# Altium schematic sheet ZHSD-Block.SchDoc
size A4; DrawnBy: UGUR KELES; DocumentNumber: 2; SheetNumber: 1; SheetTotal: 16; Size: A4
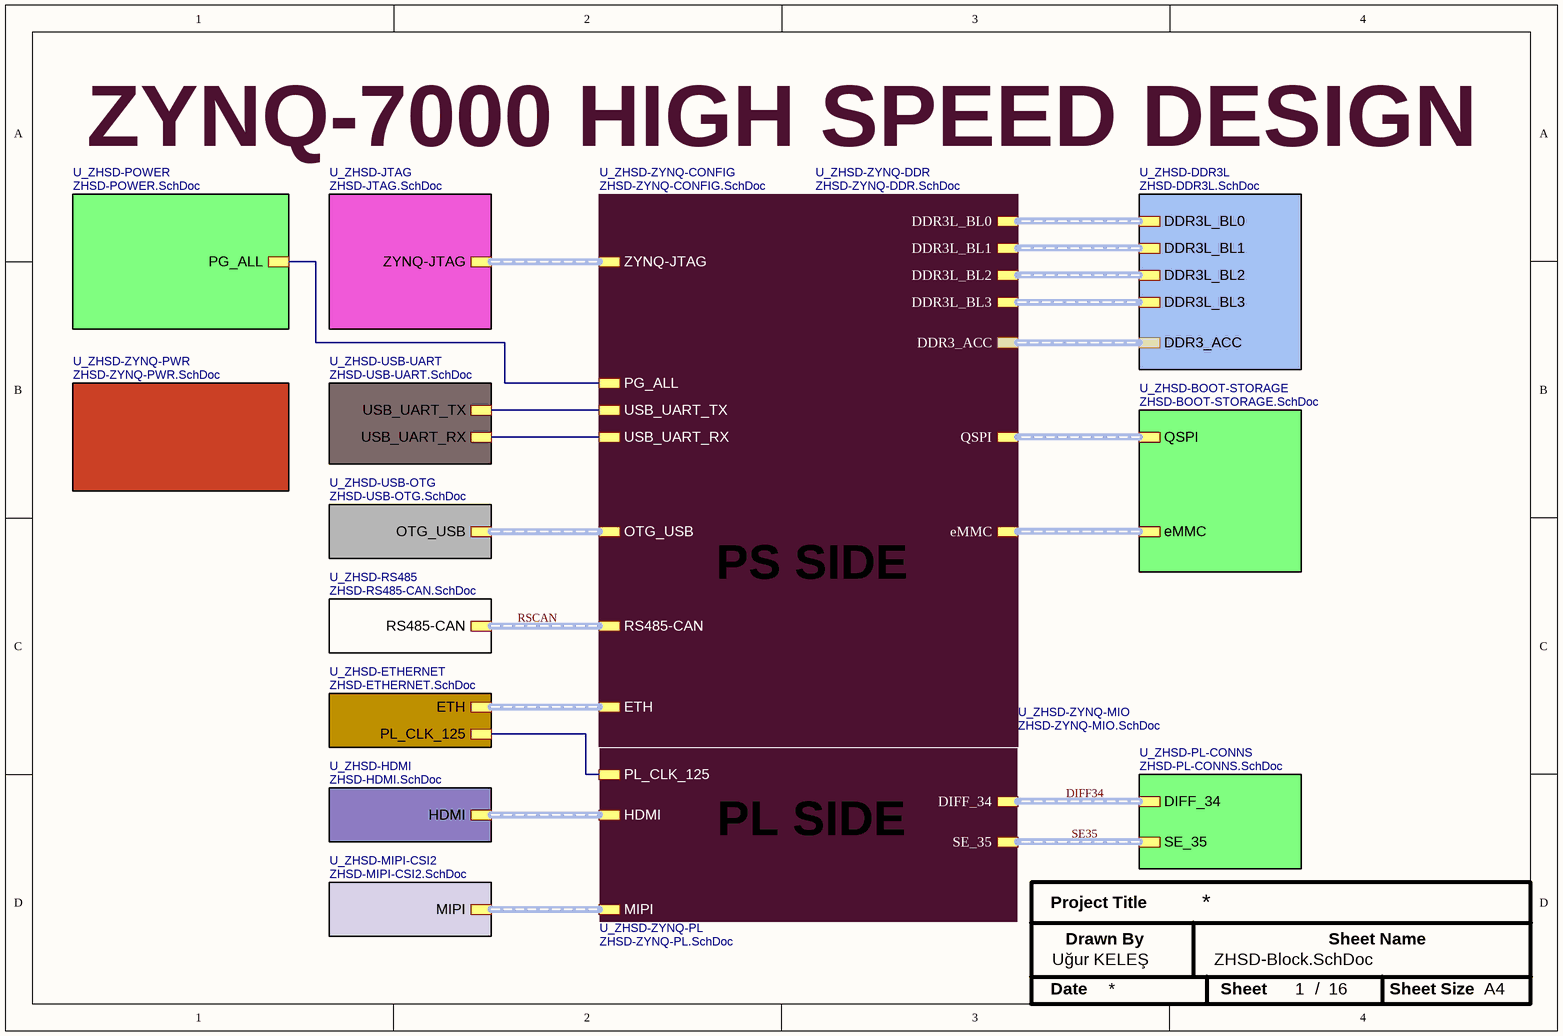
[diagram p0: ZHSD-Block.SchDoc]

## Sub-sheets
U_ZHSD-BOOT-STORAGE = ZHSD-BOOT-STORAGE.SchDoc: QSPI (harness QSPI), eMMC (harness eMMC)
U_ZHSD-DDR3L = ZHSD-DDR3L.SchDoc: DDR3_ACC (harness DDR3_ACC), DDR3L_BL0 (harness DDR_H_BL0), DDR3L_BL1 (harness DDR_H_BL1), DDR3L_BL2 (harness DDR_H_BL2), DDR3L_BL3 (harness DDR_H_BL3)
U_ZHSD-ETHERNET = ZHSD-ETHERNET.SchDoc: ETH (harness ETH), PL_CLK_125
U_ZHSD-HDMI = ZHSD-HDMI.SchDoc: HDMI (harness HDMI)
U_ZHSD-JTAG = ZHSD-JTAG.SchDoc: ZYNQ-JTAG (harness JTAG)
U_ZHSD-MIPI-CSI2 = ZHSD-MIPI-CSI2.SchDoc: MIPI (harness MIPI)
U_ZHSD-PL-CONNS = ZHSD-PL-CONNS.SchDoc: DIFF_34 (harness PL34_DIFF), SE_35 (harness PL35_SE)
U_ZHSD-POWER = ZHSD-POWER.SchDoc: PG_ALL
U_ZHSD-RS485 = ZHSD-RS485-CAN.SchDoc: RS485-CAN (harness RS485-CAN)
U_ZHSD-USB-OTG = ZHSD-USB-OTG.SchDoc: OTG_USB (harness OTG)
U_ZHSD-USB-UART = ZHSD-USB-UART.SchDoc: USB_UART_TX, USB_UART_RX
U_ZHSD-ZYNQ-CONFIG = ZHSD-ZYNQ-CONFIG.SchDoc: ZYNQ-JTAG (harness JTAG)
U_ZHSD-ZYNQ-DDR = ZHSD-ZYNQ-DDR.SchDoc: DDR3L_BL0 (harness DDR_H_BL0), DDR3_ACC (harness DDR3_ACC), DDR3L_BL1 (harness DDR_H_BL1), DDR3L_BL2 (harness DDR_H_BL2), DDR3L_BL3 (harness DDR_H_BL3)
U_ZHSD-ZYNQ-MIO = ZHSD-ZYNQ-MIO.SchDoc: QSPI (harness QSPI), eMMC (harness eMMC), OTG_USB (harness OTG), ETH (harness ETH), USB_UART_TX, USB_UART_RX, RS485-CAN (harness RS485-CAN), PG_ALL
U_ZHSD-ZYNQ-PL = ZHSD-ZYNQ-PL.SchDoc: HDMI (harness HDMI), MIPI (harness MIPI), PL_CLK_125, DIFF_34 (harness PL34_DIFF), SE_35 (harness PL35_SE)
U_ZHSD-ZYNQ-PWR = ZHSD-ZYNQ-PWR.SchDoc: no entries

## Nets
(unnamed): sheet U_ZHSD-ZYNQ-MIO/USB_UART_TX, sheet U_ZHSD-USB-UART/USB_UART_TX
(unnamed): sheet U_ZHSD-ZYNQ-MIO/USB_UART_RX, sheet U_ZHSD-USB-UART/USB_UART_RX
(unnamed): sheet U_ZHSD-ZYNQ-MIO/PG_ALL, sheet U_ZHSD-POWER/PG_ALL
(unnamed): sheet U_ZHSD-ETHERNET/PL_CLK_125, sheet U_ZHSD-ZYNQ-PL/PL_CLK_125

## Buses and harness runs
harness DIFF34 = sheet U_ZHSD-PL-CONNS/DIFF_34 = sheet U_ZHSD-ZYNQ-PL/DIFF_34
harness RSCAN = sheet U_ZHSD-RS485/RS485-CAN = sheet U_ZHSD-ZYNQ-MIO/RS485-CAN
harness SE35 = sheet U_ZHSD-PL-CONNS/SE_35 = sheet U_ZHSD-ZYNQ-PL/SE_35
harness sheet U_ZHSD-BOOT-STORAGE/eMMC = sheet U_ZHSD-ZYNQ-MIO/eMMC
harness sheet U_ZHSD-BOOT-STORAGE/QSPI = sheet U_ZHSD-ZYNQ-MIO/QSPI
harness sheet U_ZHSD-DDR3L/DDR3_ACC = sheet U_ZHSD-ZYNQ-DDR/DDR3_ACC
harness sheet U_ZHSD-DDR3L/DDR3L_BL0 = sheet U_ZHSD-ZYNQ-DDR/DDR3L_BL0
harness sheet U_ZHSD-DDR3L/DDR3L_BL1 = sheet U_ZHSD-ZYNQ-DDR/DDR3L_BL1
harness sheet U_ZHSD-DDR3L/DDR3L_BL2 = sheet U_ZHSD-ZYNQ-DDR/DDR3L_BL2
harness sheet U_ZHSD-DDR3L/DDR3L_BL3 = sheet U_ZHSD-ZYNQ-DDR/DDR3L_BL3
harness sheet U_ZHSD-ETHERNET/ETH = sheet U_ZHSD-ZYNQ-MIO/ETH
harness sheet U_ZHSD-HDMI/HDMI = sheet U_ZHSD-ZYNQ-PL/HDMI
harness sheet U_ZHSD-JTAG/ZYNQ-JTAG = sheet U_ZHSD-ZYNQ-CONFIG/ZYNQ-JTAG
harness sheet U_ZHSD-MIPI-CSI2/MIPI = sheet U_ZHSD-ZYNQ-PL/MIPI
harness sheet U_ZHSD-USB-OTG/OTG_USB = sheet U_ZHSD-ZYNQ-MIO/OTG_USB

## Notes on the sheet
- ZYNQ-7000 HIGH SPEED DESIGN
- PS SIDE
- PL SIDE
- Project Title
- Uğur KELEŞ
- Drawn By
- Sheet Name
- Date
- Sheet
- /
- Sheet Size
- A4